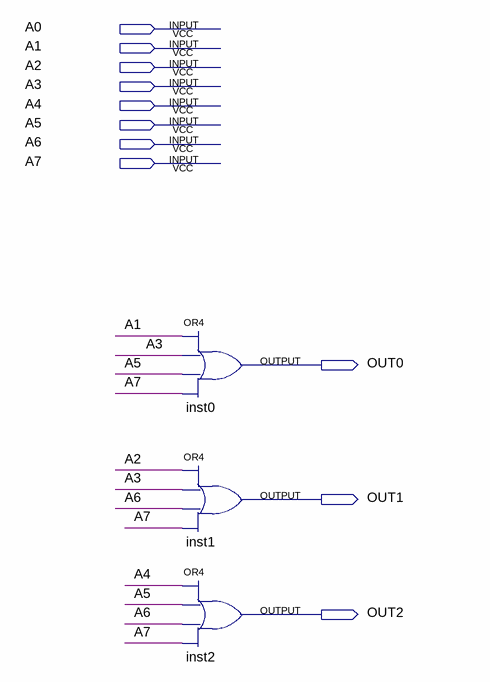
[diagram p0: schematic sheet]
// Quartus schematic ENC8.bdf as structural Verilog: 3 symbols, 11 pins
module ENC8 (
  input  A0,
  input  A1,
  input  A2,
  input  A3,
  input  A4,
  input  A5,
  input  A6,
  input  A7,
  output OUT0,
  output OUT1,
  output OUT2
);

  or inst0 (OUT0, A1, A3, A5, A7);
  or inst1 (OUT1, A2, A3, A6, A7);
  or inst2 (OUT2, A4, A5, A6, A7);
endmodule
